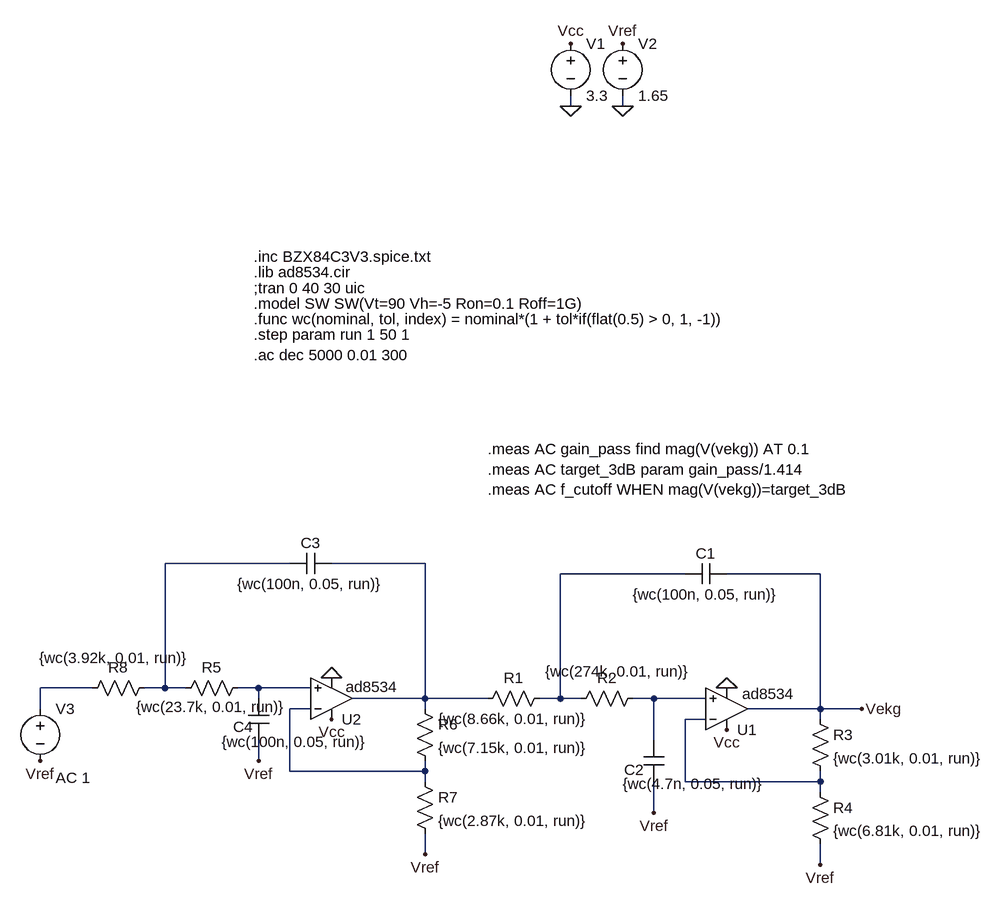
[diagram p0: schematic Tolerante FTJ.asc]
Tolerante FTJ.asc, the LTspice schematic file:
Version 4.1
SHEET 1 880 960
WIRE 160 -288 160 -304
WIRE 240 -288 240 -304
WIRE -272 416 -464 416
WIRE -64 416 -208 416
WIRE 336 432 144 432
WIRE 544 432 400 432
WIRE -576 608 -656 608
WIRE -464 608 -464 416
WIRE -464 608 -496 608
WIRE -432 608 -464 608
WIRE -320 608 -352 608
WIRE -240 608 -320 608
WIRE -320 624 -320 608
WIRE -64 624 -64 416
WIRE -64 624 -176 624
WIRE 32 624 -64 624
WIRE 144 624 144 432
WIRE 144 624 112 624
WIRE 176 624 144 624
WIRE 288 624 256 624
WIRE 368 624 288 624
WIRE -656 640 -656 608
WIRE -240 640 -272 640
WIRE -64 640 -64 624
WIRE 544 640 544 432
WIRE 544 640 432 640
WIRE 608 640 544 640
WIRE 368 656 336 656
WIRE 544 656 544 640
WIRE 288 688 288 624
WIRE -320 720 -320 688
WIRE -272 736 -272 640
WIRE -64 736 -64 720
WIRE -64 736 -272 736
WIRE -64 752 -64 736
WIRE 336 752 336 656
WIRE 544 752 544 736
WIRE 544 752 336 752
WIRE 544 768 544 752
WIRE 288 800 288 752
WIRE -64 864 -64 832
WIRE 544 880 544 848
FLAG 240 -288 0
FLAG 160 -288 0
FLAG 240 -384 Vref
FLAG 160 -384 Vcc
FLAG 288 800 Vref
FLAG 400 608 0
FLAG 400 672 Vcc
FLAG 608 640 Vekg
FLAG 544 880 Vref
FLAG -320 720 Vref
FLAG -208 592 0
FLAG -208 656 Vcc
FLAG -64 864 Vref
FLAG -656 720 Vref
SYMBOL voltage 160 -400 R0
SYMATTR InstName V1
SYMATTR Value 3.3
SYMBOL voltage 240 -400 R0
SYMATTR InstName V2
SYMATTR Value 1.65
SYMBOL res 128 608 R90
WINDOW 0 0 56 VBottom 2
WINDOW 3 32 56 VTop 2
SYMATTR InstName R1
SYMATTR Value {wc(8.66k, 0.01, run)}
SYMBOL res 272 608 R90
WINDOW 0 0 56 VBottom 2
WINDOW 3 -41 39 VTop 2
SYMATTR InstName R2
SYMATTR Value {wc(274k, 0.01, run)}
SYMBOL cap 400 416 R90
WINDOW 0 0 32 VBottom 2
WINDOW 3 32 32 VTop 2
SYMATTR InstName C1
SYMATTR Value {wc(100n, 0.05, run)}
SYMBOL OpAmps\\opamp2 400 704 M180
WINDOW 3 24 87 Left 2
SYMATTR Value ad8534
SYMATTR InstName U1
SYMBOL cap 272 688 R0
WINDOW 0 -30 46 Left 2
WINDOW 3 -32 67 Left 2
SYMATTR InstName C2
SYMATTR Value {wc(4.7n, 0.05, run)}
SYMBOL res 528 640 R0
SYMATTR InstName R3
SYMATTR Value {wc(3.01k, 0.01, run)}
SYMBOL res 528 752 R0
SYMATTR InstName R4
SYMATTR Value {wc(6.81k, 0.01, run)}
SYMBOL res -336 592 R90
WINDOW 0 0 56 VBottom 2
WINDOW 3 29 57 VTop 2
SYMATTR InstName R5
SYMATTR Value {wc(23.7k, 0.01, run)}
SYMBOL cap -208 400 R90
WINDOW 0 0 32 VBottom 2
WINDOW 3 32 32 VTop 2
SYMATTR InstName C3
SYMATTR Value {wc(100n, 0.05, run)}
SYMBOL OpAmps\\opamp2 -208 688 M180
WINDOW 3 22 82 Left 2
SYMATTR Value ad8534
SYMATTR InstName U2
SYMBOL cap -336 624 R0
WINDOW 0 -23 44 Left 2
WINDOW 3 -41 67 Left 2
SYMATTR InstName C4
SYMATTR Value {wc(100n, 0.05, run)}
SYMBOL res -80 624 R0
SYMATTR InstName R6
SYMATTR Value {wc(7.15k, 0.01, run)}
SYMBOL res -80 736 R0
SYMATTR InstName R7
SYMATTR Value {wc(2.87k, 0.01, run)}
SYMBOL res -480 592 R90
WINDOW 0 0 56 VBottom 2
WINDOW 3 -46 62 VTop 2
SYMATTR InstName R8
SYMATTR Value {wc(3.92k, 0.01, run)}
SYMBOL voltage -656 624 R0
WINDOW 123 24 122 Left 2
WINDOW 39 0 0 Left 0
SYMATTR Value2 AC 1
SYMATTR InstName V3
SYMATTR Value ""
TEXT -328 -32 Left 2 !.lib ad8534.cir
TEXT -328 -8 Left 2 !;tran 0 40 30 uic
TEXT -328 16 Left 2 !.model SW SW(Vt=90 Vh=-5 Ron=0.1 Roff=1G)
TEXT -328 -56 Left 2 !.inc BZX84C3V3.spice.txt
TEXT -328 40 Left 2 !.func wc(nominal, tol, index) = nominal*(1 + tol*if(flat(0.5) > 0, 1, -1))
TEXT -328 64 Left 2 !.step param run 1 50 1\n.ac dec 5000 0.01 300
TEXT 32 240 Left 2 !.meas AC gain_pass find mag(V(vekg)) AT 0.1\n.meas AC target_3dB param gain_pass/1.414\n.meas AC f_cutoff WHEN mag(V(vekg))=target_3dB

The netlist it stands for:
* Tolerante FTJ.asc
V1 Vcc 0 3.3
V2 Vref 0 1.65
R1 N003 N002 {wc(8.66k, 0.01, run)}
R2 N006 N003 {wc(274k, 0.01, run)}
C1 Vekg N003 {wc(100n, 0.05, run)}
X§U1 N006 N008 Vcc 0 Vekg ad8534  ; pins In+ In- V+ V- OUT
C2 N006 Vref {wc(4.7n, 0.05, run)}
R3 Vekg N008 {wc(3.01k, 0.01, run)}
R4 N008 Vref {wc(6.81k, 0.01, run)}
R5 N005 N001 {wc(23.7k, 0.01, run)}
C3 N002 N001 {wc(100n, 0.05, run)}
X§U2 N005 N007 Vcc 0 N002 ad8534  ; pins In+ In- V+ V- OUT
C4 N005 Vref {wc(100n, 0.05, run)}
R6 N002 N007 {wc(7.15k, 0.01, run)}
R7 N007 Vref {wc(2.87k, 0.01, run)}
R8 N001 N004 {wc(3.92k, 0.01, run)}
V3 N004 Vref AC 1
.lib ad8534.cir
;tran 0 40 30 uic
.model SW SW(Vt=90 Vh=-5 Ron=0.1 Roff=1G)
.inc BZX84C3V3.spice.txt
.func wc(nominal, tol, index) = nominal*(1 + tol*if(flat(0.5) > 0, 1, -1))
.step param run 1 50 1
.ac dec 5000 0.01 300
.meas AC gain_pass find mag(V(vekg)) AT 0.1
.meas AC target_3dB param gain_pass/1.414
.meas AC f_cutoff WHEN mag(V(vekg))=target_3dB
.backanno
.end